# EAGLE design PCB-MicroBI16 (EAGLE 7.5.0)

## Sheet 1 of 2
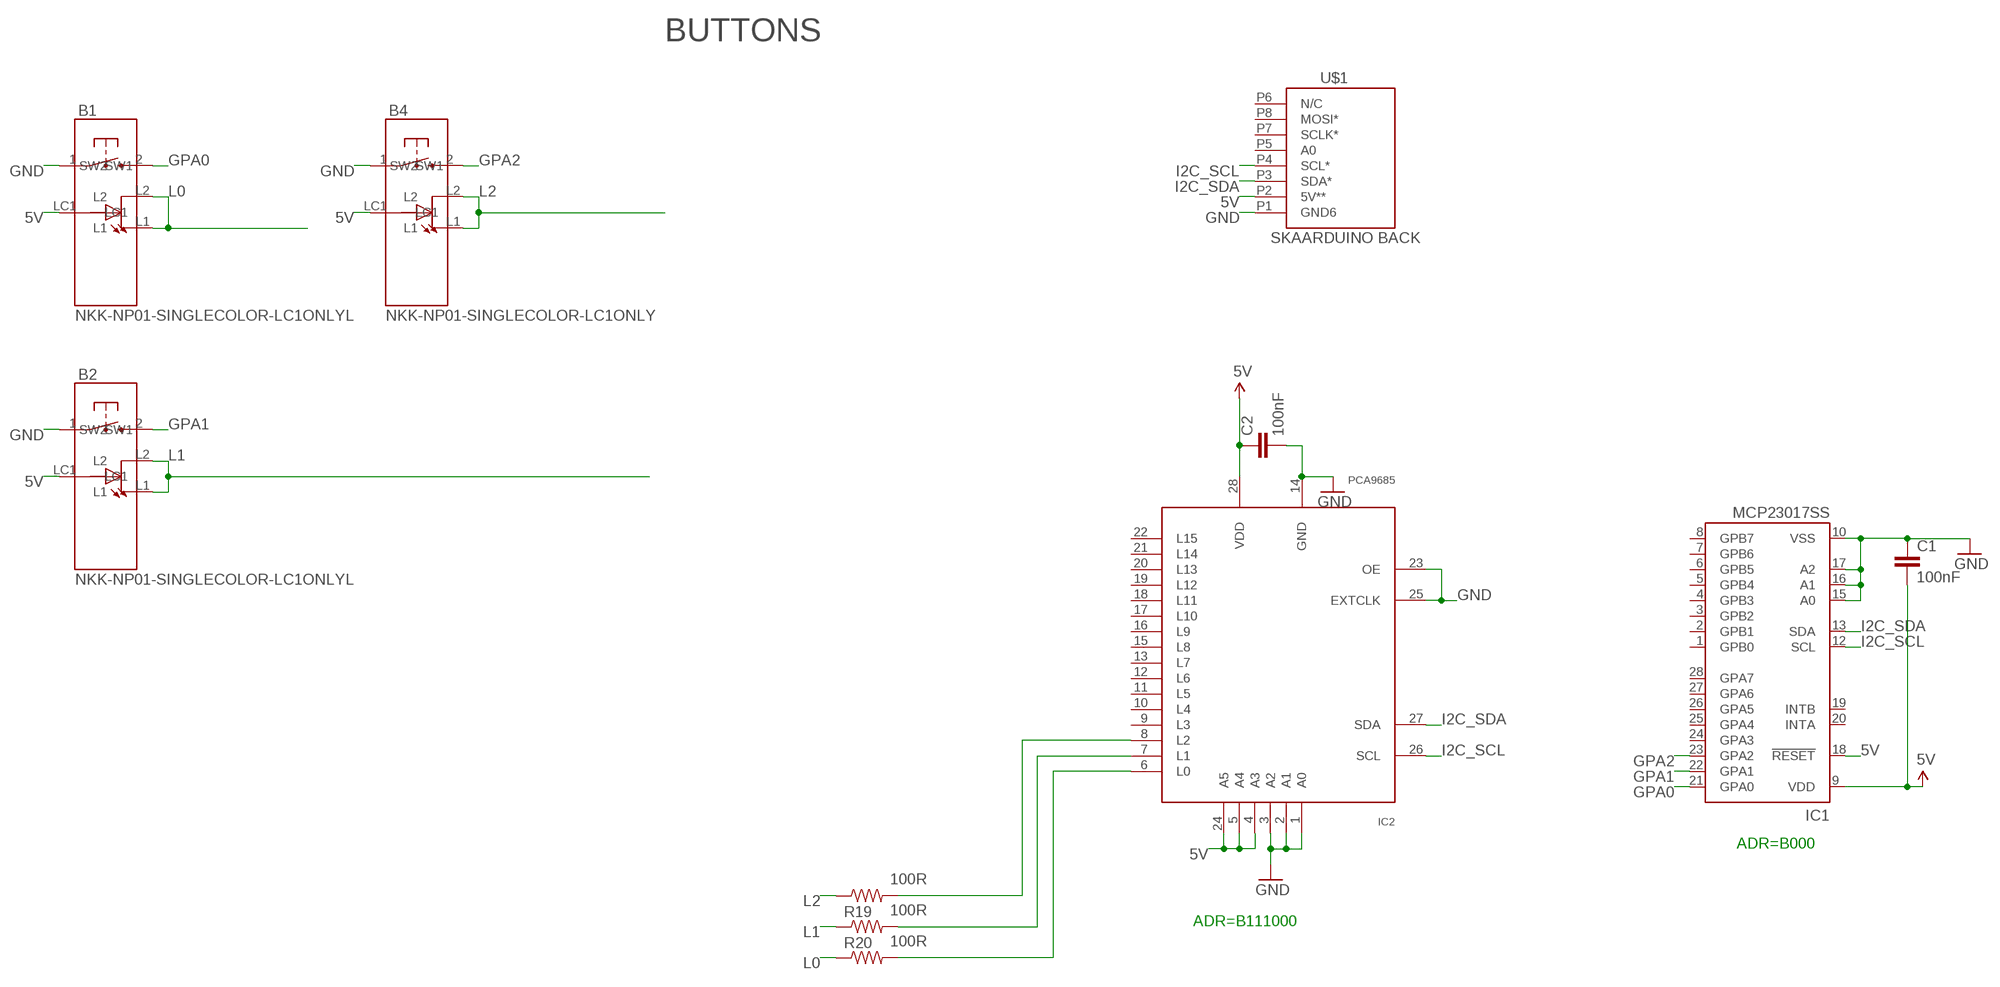
[diagram p0: schematic, sheet 1]

### Parts
B1  NKK-NP01-SINGLECOLOR-LC1ONLYL  [NKK-NP01_LESSHOLES3]
B2  NKK-NP01-SINGLECOLOR-LC1ONLYL  [NKK-NP01_LESSHOLES3]
B4  NKK-NP01-SINGLECOLOR-LC1ONLY  [NKK-NP01_LESSHOLES2]
C1  100nF  CAP0603-CAP  [0603-CAP]
C2  100nF  CAP0603-CAP  [0603-CAP]
IC1  MCP23017SS  [SSOP28]
IC2  PCA9685  [TSSOP28]
R18  100R  RESISTOR0603-RES  [0603-RES]
R19  100R  RESISTOR0603-RES  [0603-RES]
R20  100R  RESISTOR0603-RES  [0603-RES]
U$1  SKAARDUINO_BACK_SERIAL  [SKAARDUINO_BACK_PTH_SERIAL]

### Nets
5V [Power]: B1.LC1 B2.LC1 B4.LC1 C1.2 C2.1 IC1.9(VDD) IC1.18(!RESET) IC2.4(A3) IC2.5(A4) IC2.24(A5) IC2.28(VDD) U$1.P2(5V**)
GND [Power]: B1.1(SW1) B2.1(SW1) B4.1(SW1) C1.1 C2.2 IC1.10(VSS) IC1.15(A0) IC1.16(A1) IC1.17(A2) IC2.1(A0) IC2.2(A1) IC2.3(A2) IC2.14(GND) IC2.23(OE) IC2.25(EXTCLK) U$1.P1(GND6)
GPA0: B1.2(SW2) IC1.21(GPA0)
GPA1: B2.2(SW2) IC1.22(GPA1)
GPA2: B4.2(SW2) IC1.23(GPA2)
I2C_SCL: IC1.12(SCL) IC2.26(SCL) U$1.P4(SCL*)
I2C_SDA: IC1.13(SDA) IC2.27(SDA) U$1.P3(SDA*)
L0: B1.L1 B1.L2 R20.1
L1: B2.L1 B2.L2 R19.1
L2: B4.L1 B4.L2 R18.1
N$11: IC2.8(L2) R18.2
N$12: IC2.7(L1) R19.2
N$19: IC2.6(L0) R20.2
Unconnected: IC1.1(GPB0) IC1.2(GPB1) IC1.3(GPB2) IC1.4(GPB3) IC1.5(GPB4) IC1.6(GPB5) IC1.7(GPB6) IC1.8(GPB7) IC1.19(INTB) IC1.20(INTA) IC1.24(GPA3) IC1.25(GPA4) IC1.26(GPA5) IC1.27(GPA6) IC1.28(GPA7) IC2.9(L3) IC2.10(L4) IC2.11(L5) IC2.12(L6) IC2.13(L7) IC2.15(L8) IC2.16(L9) IC2.17(L10) IC2.18(L11) IC2.19(L12) IC2.20(L13) IC2.21(L14) IC2.22(L15) U$1.P5(A0) U$1.P6(N/C) U$1.P7(SCLK*) U$1.P8(MOSI*)

### Notes on the sheet
- BUTTONS
- ADR=B000
- ADR=B111000

## Sheet 2 of 2

## Library data of the parts
B1 B2 B4 = SKAARHOJ:NKK-NP01-SINGLECOLOR-LC1ONLY
C1 C2 = SparkFun:CAP: Capacitor Standard 0603 ceramic capacitor, and 0.1" leaded capacitor.
IC1 = microchip:MCP23017: http://ww1.microchip.com/downloads/en/DeviceDoc/21952a.pdf Source: http://ww1.microchip.com/downloads/en/DeviceDoc/21952a.pdf; MF: MICROCHIP; MPN: MCP23017-E/SS; OC_FARNELL: 1467674; OC_NEWARK: 31K2960
IC2 = wsmith:PCA9685
R18-R20 = SparkFun:RESISTOR: Resistor Basic schematic elements and footprints for 0603, 1206, and PTH resistors.
U$1 = SKAARHOJ:SKAARDUINO_BACK_SERIAL

## Net classes
0 default: width 0.203 mm, drill 0.305 mm, clearance 0.203 mm
1 Power: width 0.305 mm, drill 0.61 mm, clearance 0.203 mm

## Board
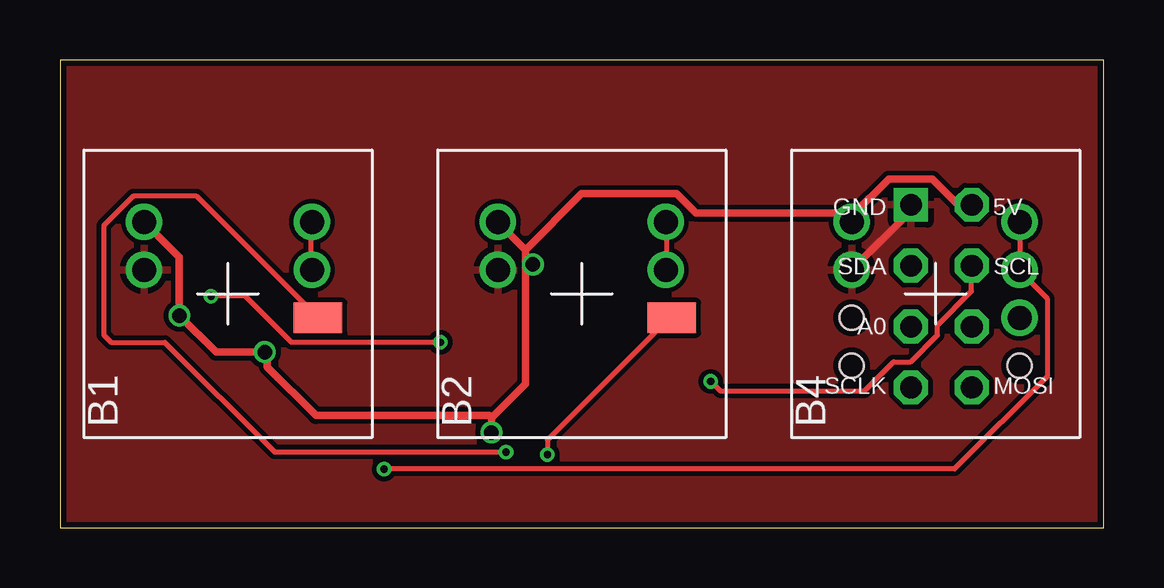
[diagram p1: board, top side]
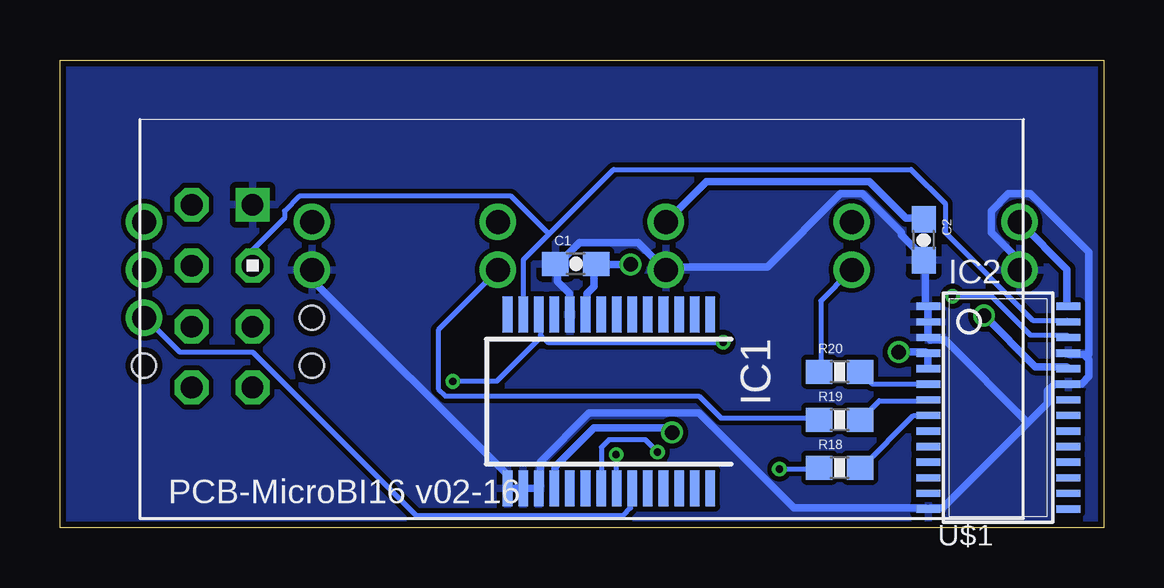
[diagram p2: board, bottom side, seen from below]

Size 43.5 x 19.5 mm. Coordinates in mm from the lower left corner, seen from the top.
Outline: 0,0 43.5,0 43.5,19.5 0,19.5 0,0
Copper layers (1*16): Top 0.035mm / dielectric 1.5mm / Bottom 0.035mm
Design rules "Fusion_eagle_rule_v1.1": minimum track width 6mil, minimum drill 12mil, track to track 6mil, track to pad 6mil, pad to pad 6mil, via to via 6mil, smd to smd 0mil, copper to edge 10mil, drill to drill 10mil, minimum pad ring 10mil, minimum via ring 6mil, stop-mask expansion 2mil, vias tented up to drill 100mil, thermal gap 10mil

### Footprints (pad centres in the part's own frame; a part is rotated, then mirrored left to right if it is on the bottom)
NKK-NP01_LESSHOLES3 = drill 1: 1 1,3.5; L1 3,-3.5; L2 1,-3.5; LC1 3,3.5 | smd 1.27 x 2.032: 2 -1,-3.754
NKK-NP01_LESSHOLES2 = drill 1: 1 1,3.5; 2 -1,-3.5; L1 3,-3.5; L2 1,-3.5; LC1 3,3.5 | hole 1: -3,3.5; -3,-3.5; -1,3.5
0603-CAP = smd 1.1 x 1: 1 -0.85,0; 2 0.85,0
SSOP28 = smd 0.4 x 1.5: 1 -4.225,-3.625; 2 -3.575,-3.625; 3 -2.925,-3.625; 4 -2.275,-3.625; 5 -1.625,-3.625; 6 -0.975,-3.625; 7 -0.325,-3.625; 8 0.325,-3.625; 9 0.975,-3.625; 10 1.625,-3.625; 11 2.275,-3.625; 12 2.925,-3.625; 13 3.575,-3.625; 14 4.225,-3.625; 15 4.225,3.625; 16 3.575,3.625; 17 2.925,3.625; 18 2.275,3.625; 19 1.625,3.625; 20 0.975,3.625; 21 0.325,3.625; 22 -0.325,3.625; 23 -0.975,3.625; 24 -1.625,3.625; 25 -2.275,3.625; 26 -2.925,3.625; 27 -3.575,3.625; 28 -4.225,3.625
TSSOP28 = smd 0.305 x 0.991: 1 -4.225,-2.918; 2 -3.575,-2.918; 3 -2.925,-2.918; 4 -2.275,-2.918; 5 -1.625,-2.918; 6 -0.975,-2.918; 7 -0.325,-2.918; 8 0.325,-2.918; 9 0.975,-2.918; 10 1.625,-2.918; 11 2.275,-2.918; 12 2.925,-2.918; 13 3.575,-2.918; 14 4.225,-2.918; 15 4.225,2.918; 16 3.575,2.918; 17 2.925,2.918; 18 2.275,2.918; 19 1.625,2.918; 20 0.975,2.918; 21 0.325,2.918; 22 -0.325,2.918; 23 -0.975,2.918; 24 -1.625,2.918; 25 -2.275,2.918; 26 -2.925,2.918; 27 -3.575,2.918; 28 -4.225,2.918
0603-RES = smd 1.1 x 1: 1 -0.85,0; 2 0.85,0
SKAARDUINO_BACK_PTH_SERIAL = drill 0.9 square: P1 13.97,32.131 | drill 0.9 octagon: P2 13.97,34.671; P3 11.43,32.131; P4 11.43,34.671; P5 8.89,32.131; P6 8.89,34.671; P7 6.35,32.131; P8 6.35,34.671

### Placement (x,y rotation side)
B1  7,9.75 90 top
B2  21.75,9.75 90 top
B4  36.5,9.75 90 top
C1  22,11 0 bottom
C2  7.5,12 270 bottom
IC1  20.62,5.25 180 bottom
IC2  4.39,5 270 bottom
R18  11,2.5 0 bottom
R19  11,4.5 0 bottom
R20  11,6.5 0 bottom
U$1  3.34,-0.51 90 bottom

### Tracks (layer width: path | path; a pad name or v marks a point on that pad's centre or on a via)
5V  (via drill 0.61)
  Top 0.305: B1.LC1 3.56,12.7 4.98,11.28 v4.98,8.84 6.5,7.32 v8.53,7.32 8.64,7.21 8.64,6.71 10.67,4.67 17.88,4.67 17.98,4.57 | U$1.P2 38,13.51 37.39,13.51 36.37,14.53 34.54,14.53 33.02,13.01 33.02,12.8 B4.LC1 32.92,13.11 26.52,13.11 25.7,13.92 21.74,13.92 19.41,11.58 | 17.98,4.57 v17.98,3.96 | 17.98,4.57 19.41,5.99 19.41,10.97 | 19.41,11.58 19.41,10.97 | 19.41,11.58 18.29,12.7 B2.LC1 | 19.41,10.97 v19.71,10.97
  Bottom 0.305: IC2.5 7.32,6.71 7.32,7.21 IC2.4 7.42,7.32 v8.53,7.32 | v4.98,8.84 2.85,6.71 1.52,6.71 IC2.24 | IC2.28 1.52,9.25 1.52,10.77 3.45,12.7 B1.LC1 | IC1.9 21.54,8.94 21.54,9.75 21.23,10.06 21.23,10.97 C1.2 21.03,10.97 v19.71,10.97 | C2.1 7.52,12.9 8.23,12.9 9.75,14.43 16.56,14.43 18.19,12.8 B2.LC1 | v17.98,3.96 18.19,4.17 21.23,4.17 22.86,2.54 22.86,1.73 IC1.18
GND
  Top 0.305: U$1.P1 35.46,13.41 35.46,13.21 33.02,10.77 B4.1
  Bottom 0.305: B4.1 32.92,10.67 32.92,10.26 24.89,2.23 24.89,1.73 IC1.15 24.79,1.63 24.28,1.63 IC1.16 23.57,1.63 IC1.17 23.47,1.73 23.47,2.74 21.44,4.78 16.87,4.78 12.9,0.81 7.42,0.81 IC2.14 7.21,0.81 6.71,0.81 3.15,4.37 | IC1.10 22.25,8.94 22.25,9.75 22.76,10.26 22.76,10.97 C1.1 22.66,11.07 21.84,11.89 19.41,11.89 18.29,10.77 B2.1 18.19,10.87 14.02,10.87 10.97,13.92 10.06,13.92 8.43,12.29 8.43,12.19 7.52,11.28 C2.2 7.42,11.07 7.42,9.25 IC2.1 7.32,9.14 7.32,8.64 IC2.2 7.32,8.53 7.32,8.03 IC2.3 7.21,7.82 6.6,7.82 3.15,4.37 | 0.71,7.11 0.81,7.21 1.42,7.21 IC2.25 | 0.71,7.11 0.61,7.01 0.61,6.3 0.91,5.99 1.42,5.99 IC2.23 1.63,5.99 2.03,5.99 2.34,5.69 2.34,5.18 3.15,4.37 | B1.1 3.56,10.77 3.56,11.18 4.67,12.29 4.67,13.21 3.96,13.92 3.05,13.92 0.61,11.48 0.61,7.21 0.71,7.11
  pour Top: 0,0 43.5,0 43.5,19.5 0,19.5
  pour Bottom: 0,0 43.5,0 43.5,19.5 0,19.5
GPA0  (via drill 0.3)
  Top 0.203: v18.59,3.15 8.94,3.15 4.37,7.72 2.13,7.72 1.83,8.03 1.83,12.6 3.05,13.82 5.69,13.82 10.67,8.84 B1.2
  Bottom 0.203: v18.59,3.15 19.1,3.66 20.62,3.66 20.93,3.35 20.93,1.73 IC1.21
GPA1  (via drill 0.3)
  Top 0.203: v20.32,3.05 20.32,3.66 25.5,8.84 B2.2
  Bottom 0.203: v20.32,3.05 20.32,1.73 IC1.22
GPA2
  Bottom 0.203: IC1.23 19.71,1.63 19.71,0.81 20.02,0.51 28.65,0.51 35.46,7.32 38.51,7.32 39.93,8.74 B4.2
I2C_SCL  (via drill 0.3)
  Top 0.203: v6.3,9.65 7.72,9.65 9.65,7.72 v15.85,7.72 | v27.13,6.1 27.53,5.69 33.53,5.69 34.75,6.91 35.46,6.91 36.58,8.03 36.58,8.43 38,9.86 38,10.87 U$1.P4
  Bottom 0.203: v6.3,9.65 4.67,9.65 3.05,8.03 1.52,8.03 IC2.26 | v15.85,7.72 23.16,7.72 23.42,7.98 | 23.42,7.98 23.47,8.03 23.47,8.84 IC1.12 | v27.13,6.1 25.3,6.1 23.42,7.98
I2C_SDA
  Bottom 0.203: 23.11,12.24 24.18,11.18 24.18,8.94 IC1.13 | 23.11,12.24 20.42,14.94 8.03,14.94 6.6,13.51 6.6,12.29 2.95,8.64 1.52,8.64 IC2.27 | 23.11,12.24 24.69,13.82 33.53,13.82 34.14,13.21 34.14,12.9 35.46,11.58 35.46,10.97 U$1.P3
L0
  Top 0.203: B1.L1 10.46,12.7 10.46,10.77 B1.L2
  Bottom 0.203: R20.1 11.79,6.5 11.79,9.45 10.57,10.67 B1.L2
L1
  Top 0.203: B2.L1 25.3,12.7 25.3,10.77 B2.L2
  Bottom 0.203: R19.1 11.89,4.57 15.95,4.57 16.87,5.49 27.43,5.49 27.74,5.79 27.74,8.23 25.3,10.67 B2.L2
L2  (via drill 0.3)
  Top 0.203: v13.51,2.44 37.29,2.44 41.15,6.3 41.15,9.55 40.03,10.67 B4.L2 40.03,10.77 40.03,12.7 B4.L1
  Bottom 0.203: v13.51,2.44 11.89,2.44 R18.1
N$11
  Bottom 0.203: IC2.8 7.92,4.67 10.06,2.54 R18.2
N$12
  Bottom 0.203: IC2.7 7.32,5.28 9.35,5.28 10.06,4.57 R19.2
N$19
  Bottom 0.203: IC2.6 7.32,5.99 9.65,5.99 10.06,6.4 R20.2

### Text on the board
_bsilk: PCB-MicroBI16 v02-16